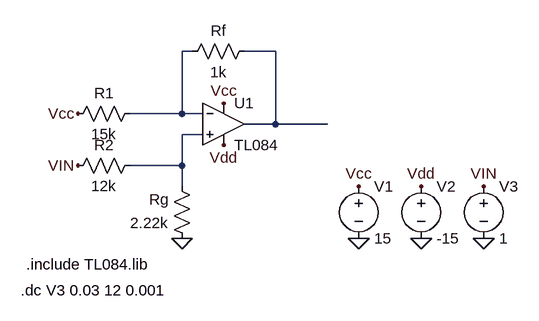
[diagram p0: schematic DomaineDef.asc]
DomaineDef.asc, the LTspice schematic file:
Version 4
SHEET 1 880 680
WIRE 160 32 144 32
WIRE 288 32 240 32
WIRE 144 128 144 32
WIRE 144 128 64 128
WIRE 176 128 144 128
WIRE 288 144 288 32
WIRE 288 144 240 144
WIRE 368 144 288 144
WIRE 176 160 144 160
WIRE 144 208 144 160
WIRE 144 208 64 208
WIRE 144 240 144 208
FLAG 416 320 0
FLAG 512 320 0
FLAG 608 320 0
FLAG 416 240 Vcc
FLAG 208 112 Vcc
FLAG 512 240 Vdd
FLAG 208 176 Vdd
FLAG -16 128 Vcc
FLAG 608 240 VIN
FLAG -16 208 VIN
FLAG 144 320 0
SYMBOL res 80 112 R90
WINDOW 0 0 56 VBottom 2
WINDOW 3 32 56 VTop 2
SYMATTR InstName R1
SYMATTR Value 15k
SYMBOL res 80 192 R90
WINDOW 0 0 56 VBottom 2
WINDOW 3 32 56 VTop 2
SYMATTR InstName R2
SYMATTR Value 12k
SYMBOL res 256 16 R90
WINDOW 0 0 56 VBottom 2
WINDOW 3 32 56 VTop 2
SYMATTR InstName Rf
SYMATTR Value 1k
SYMBOL res 160 336 R180
WINDOW 0 36 76 Left 2
WINDOW 3 36 40 Left 2
SYMATTR InstName Rg
SYMATTR Value 2.22k
SYMBOL Opamps\\opamp2 208 80 R0
SYMATTR InstName U1
SYMATTR Value TL084
SYMBOL voltage 416 224 R0
WINDOW 123 0 0 Left 0
WINDOW 39 0 0 Left 0
SYMATTR InstName V1
SYMATTR Value 15
SYMBOL voltage 512 224 R0
WINDOW 123 0 0 Left 0
WINDOW 39 0 0 Left 0
SYMATTR InstName V2
SYMATTR Value -15
SYMBOL voltage 608 224 R0
WINDOW 123 0 0 Left 0
WINDOW 39 0 0 Left 0
SYMATTR InstName V3
SYMATTR Value 1
TEXT -96 360 Left 2 !.include TL084.lib
TEXT -104 400 Left 2 !.dc V3 0.03 12 0.001

The netlist it stands for:
* DomaineDef.asc
R1 N001 Vcc 15k
R2 N003 VIN 12k
Rf N002 N001 1k
Rg 0 N003 2.22k
XU1 N003 N001 Vcc Vdd N002 TL084  ; pins In+ In- V+ V- OUT
V1 Vcc 0 15
V2 Vdd 0 -15
V3 VIN 0 1
.include TL084.lib
.dc V3 0.03 12 0.001
.backanno
.end